# Altium schematic sheet 10k ohm SCH.schdoc
size 44 x 27 mm
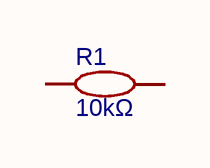
[diagram p0: 10k ohm SCH.schdoc]

## Parts
R1  10kΩ  [R0402]

## Nets

Not connected (* = marked no-connect by the designer): R1 1 2

## Library data of the parts
R1 = 10kΩ: RES SMD 10K OHM 1% 1/16W 0402; Manufacturer: YAGEO(国巨); Manufacturer Part: AC0402FR-0710KL; nameAlias: Value; Contributor: LCSC; Supplier: LCSC; Supplier Part: C144807; JLCPCB Part Class: Extended Part; spicePre: R; spiceSymbolName: AC0402FR-0710KL; LCSC Part Number: C144807